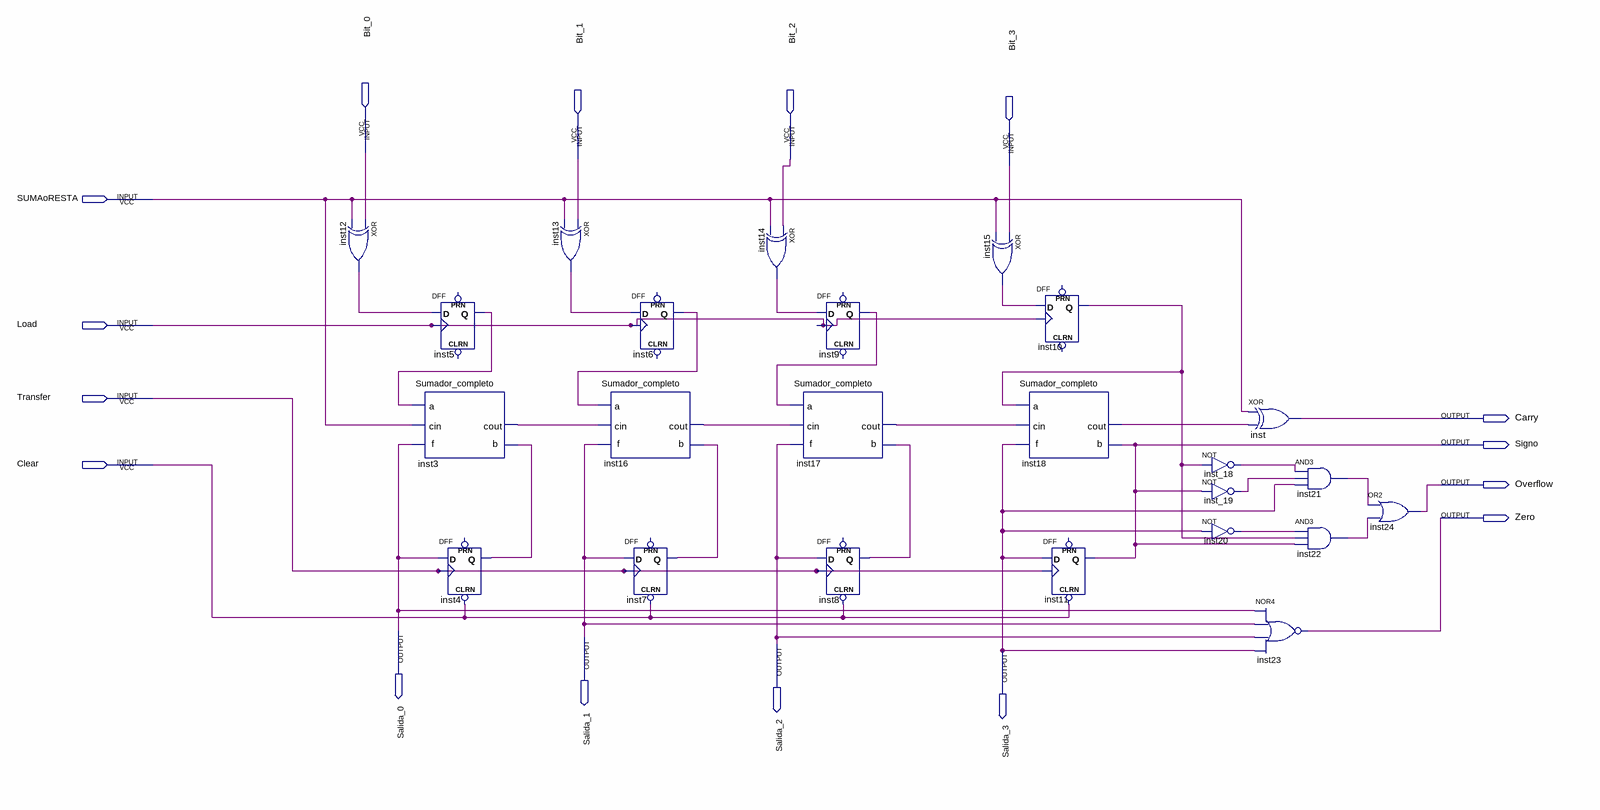
[diagram p0: schematic sheet]
// Quartus schematic Sum4bit.bdf as structural Verilog: 24 symbols, 16 pins
module Sum4bit (
  input  Bit_0,
  input  Bit_1,
  input  Bit_2,
  input  Bit_3,
  input  SUMAoRESTA,
  input  Load,
  input  Transfer,
  input  Clear,
  output Carry,
  output Signo,
  output Overflow,
  output Zero,
  output Salida_0,
  output Salida_1,
  output Salida_2,
  output Salida_3
);

  wire inst3_cout, inst4_q, inst5_q, inst6_q, inst7_q, inst8_q, inst9_q, inst10_q, inst12_out, inst13_out,
       inst14_out, inst15_out, inst16_cout, inst17_cout, inst18_cout, inst20_out, inst21_out, inst22_out,
       inst_18_out, inst_19_out;

  xor inst12 (inst12_out, Bit_0, SUMAoRESTA);
  Sumador_completo inst3 (.a(inst5_q), .b(inst4_q), .cin(SUMAoRESTA), .f(Salida_0), .cout(inst3_cout));
  DFF inst5 (.CLK(Load), .D(inst12_out), .Q(inst5_q));  // open: CLRN, PRN
  DFF inst4 (.CLRN(Clear), .CLK(Transfer), .D(Salida_0), .Q(inst4_q));  // open: PRN
  xor inst13 (inst13_out, Bit_1, SUMAoRESTA);
  DFF inst6 (.CLK(Load), .D(inst13_out), .Q(inst6_q));  // open: CLRN, PRN
  Sumador_completo inst16 (.a(inst6_q), .b(inst7_q), .cin(inst3_cout), .f(Salida_1), .cout(inst16_cout));
  DFF inst7 (.CLRN(Clear), .CLK(Transfer), .D(Salida_1), .Q(inst7_q));  // open: PRN
  xor inst14 (inst14_out, Bit_2, SUMAoRESTA);
  Sumador_completo inst17 (.a(inst9_q), .b(inst8_q), .cin(inst16_cout), .f(Salida_2), .cout(inst17_cout));
  DFF inst9 (.CLK(Load), .D(inst14_out), .Q(inst9_q));  // open: CLRN, PRN
  DFF inst8 (.CLRN(Clear), .CLK(Transfer), .D(Salida_2), .Q(inst8_q));  // open: PRN
  xor inst15 (inst15_out, Bit_3, SUMAoRESTA);
  DFF inst10 (.CLK(Load), .D(inst15_out), .Q(inst10_q));  // open: CLRN, PRN
  Sumador_completo inst18 (.a(inst10_q), .b(Signo), .cin(inst17_cout), .f(Salida_3), .cout(inst18_cout));
  DFF inst11 (.CLRN(Clear), .CLK(Transfer), .D(Salida_3), .Q(Signo));  // open: PRN
  not inst_18 (inst_18_out, inst10_q);
  not inst_19 (inst_19_out, Signo);
  not inst20 (inst20_out, Salida_3);
  xor inst (Carry, SUMAoRESTA, inst18_cout);
  nor inst23 (Zero, Salida_0, Salida_1, Salida_2, Salida_3);
  and inst21 (inst21_out, inst_18_out, inst_19_out, Salida_3);
  and inst22 (inst22_out, inst20_out, inst10_q, Signo);
  or inst24 (Overflow, inst21_out, inst22_out);
endmodule
